# Altium schematic sheet Power.SchDoc
size A4; SheetNumber: 4; SheetTotal: 5; SPICEModelCacheOQVMKSBN: <root> / <DocumentId>OQVMKSBN</DocumentId> / </root>
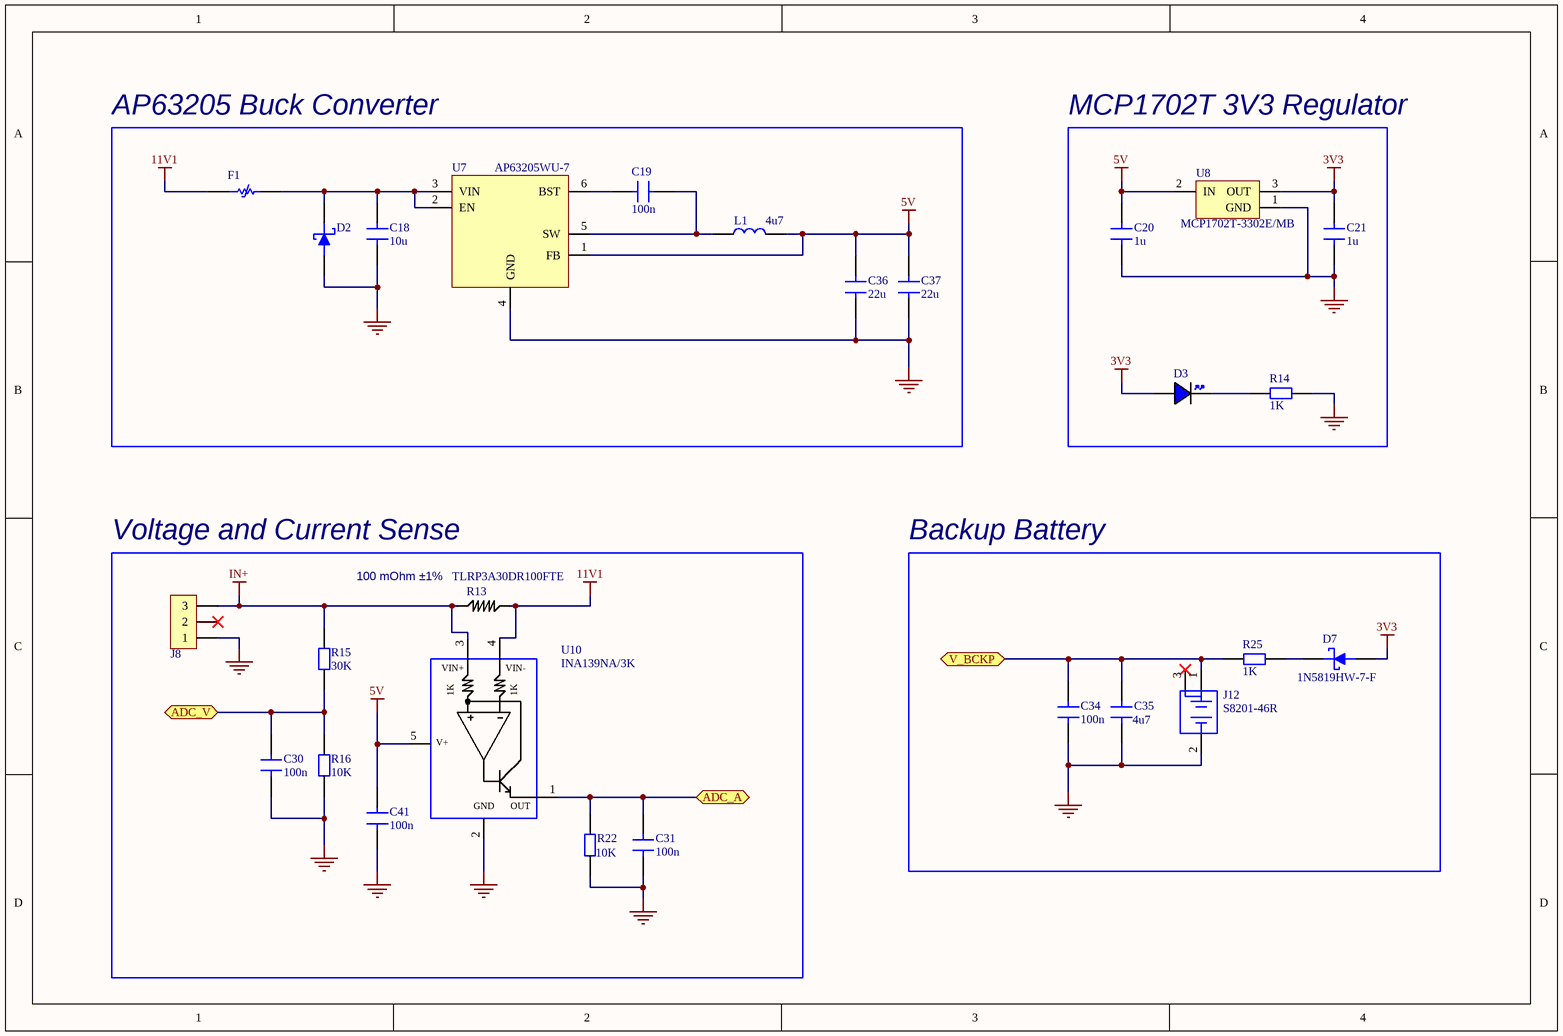
[diagram p0: Power.SchDoc]

## Parts
C18  10u  [CAP 1210]
C19  100n  [CAP 0805]
C20  1u  [CAP 0805]
C21  1u  [CAP 0805]
C30  100n  [CAP 0805]
C31  100n  [CAP 0805]
C34  100n  [CAP 0603]
C35  4u7  [CAP 0805]
C36  22u  [CAP 1210]
C37  22u  [CAP 1210]
C41  100n  [CAP 0805]
D2  SMBJ14CA  [SMBJ12CA-13-F]  (value not drawn)
D3  LED 0805 BLUE  [LED 0805 BLUE]  (value not drawn)
D7  1N5819HW-7-F  [1N5819HW-7-F]
F1  MF-MSMF075/24-2  [0ZCG0075FF2C]  (value not drawn)
J8  JST B3B-XH-A  [JST_B3B-XH-A]  (value not drawn)
J12  S8201-46R  [S8201-46R]
L1  4u7  [IHLP2020CZER4R7M11]
R13  TLRP3A30DR100FTE  [RES 2512]
R14  1K  [RES 0603]
R15  30K  [RES 0805]
R16  10K  [RES 0805]
R22  10K  [RES 0805]
R25  1K  [RES 0603]
U7  AP63205WU-7  [AP63205]
U8  MCP1702T-3302E/MB  [MCP1702T-3302E/MB]
U10  INA139NA/3K  [INA139NA]

## Blocks framed on the sheet
AP63205 Buck Converter: C18 C19 C36 C37 D2 F1 L1 U7
MCP1702T 3V3 Regulator: C20 C21 D3 R14 U8
Voltage and Current Sense: C30 C31 C41 J8 R13 R15 R16 R22 U10
Backup Battery: C34 C35 D7 J12 R25

## Ports
ADC_A (bidir, see MCU[2B]), ADC_V (bidir, see MCU[2B]), V_BCKP (bidir, see MCU[3A], Peripherals[5B])

## Nets
3V3: C21.2 D3.A D7.C U8.3(OUT)
5V: C20.2 C36.2 C37.2 C41.2 L1.2 U7.1(FB) U8.2(IN) U10.5(V+)
11V1: F1.1 R13.1 U10.4(VIN+)
GND: C18.1 C20.1 C21.1 C30.1 C31.1 C34.1 C35.1 C36.1 C37.1 C41.1 D2.1 J8.1 J12.2(-) R14.2 R16.1 R22.1 U7.4(GND) U8.1(GND) U10.2(GND)
IN+: J8.3 R13.2 R15.2 U10.3(VIN+)
ADC_A: C31.2 R22.2 U10.1(OUT) ; port ADC_A
ADC_V: C30.2 R15.1 R16.2 ; port ADC_V
V_BCKP: C34.2 C35.2 J12.1(+) R25.1 ; port V_BCKP
NetC18_2: C18.2 D2.2 F1.2 U7.2(EN) U7.3(VIN)
NetC19_1: C19.1 L1.1 U7.5(SW)
NetC19_2: C19.2 U7.6(BST)
NetD3_K: D3.K R14.1
NetD7_A: D7.A R25.2

Not connected (* = marked no-connect by the designer): J8 2*; J12 3(+)*

## Notes on the sheet
- (near R13) 100 mOhm ±1%
- (in symbol INA139NA/3K) VIN-; 1K

## Library data of the parts
C18 = CAP 1210 50V: Capacitor SMD 1210 50V
C19-C21 C30 C31 C41 = CAP 0805 50V: Capacitor SMD 0805 50V
C34 = CAP 0603 50V: Capacitor SMD 0603 50V
C35 = CAP 0805 25V: Capacitor SMD 0805 25V
C36 C37 = CAP 1210 25V: Capacitor SMD 1210 25V
D2 = SMBJ14CA: TVS DIODE 14VWM 23.2VC DO214AA; Manufacturer: Littelfuse; Operating Supply Voltage: 14V; Max Surge Current: 25.9A; Number of Channels: 1; Polarity: Bidirectional; Breakdown Voltage: 15.6V; Clamping Voltage: 23.2V; Peak Pulse Power: 600W; Power Line Protection: No; Test Current: 1mA; Leakage Current: 1uA; Diode Type: ZENER; Max Breakdown Voltage: 17.2V; Supplier 1: Future Electronics; Manufacturer Part Number: SMBJ14CA; RoHS: Yes; Category: TVS Diodes; Stock 1: 1300; Pricing 1: 1=0,36, 15=0,29, 75=0,245, 300=0,205, 1500=0,163 (USD); Mount: Surface Mount; Case/Package: DO-214AA; Number of Pins: 2; Weight: 0.00328oz; Min Operating Temperature: -65°C; Max Operating Temperature: 150°C; Packaging: Tape and Reel; Package Quantity: 3000; Reverse Breakdown Voltage: 15.6V; Number of Bidirectional Channels: 1; Reverse Standoff Voltage: 14V; Min Breakdown Voltage: 15.6V; Number of Elements: 1; Peak Pulse Current: 25.9A; Voltage Rating (DC): 14V; Series: SMBJ; Direction: Bidirectional; Termination: SMD/SMT; Max Power Dissipation: 600W; Power Dissipation: 600W; Current: 1mA; Voltage: 14V; Clamping Voltage-Max: 23.2V; Length: 5.59mm; Width: 3.94mm; Height: 2.44mm; RoHS Compliant: Yes; Lead Free: Lead Free; Reach SVHC Compliant: No; ComponentLink1URL: https://datasheet.ciiva.com/331/littelfuse-tvs-diode-smbj-datasheet-pdf-331530.pdf?src-supplier=Digikey; ComponentLink1Description: https://datasheet.ciiva.com/331/littelfuse-tvs-diode-smbj-datasheet-pdf-331530.pdf?src-supplier=Digikey; ComponentLink2URL: https://datasheet.ciiva.com/331/littelfuse-tvs-diode-smbj-datasheet-pdf-331531.pdf?src-supplier=Digikey; ComponentLink2Description: https://datasheet.ciiva.com/331/littelfuse-tvs-diode-smbj-datasheet-pdf-331531.pdf?src-supplier=Digikey; ComponentLink3URL: https://datasheet.ciiva.com/331/littelfuse-tvs-diode-smbj-datasheet-pdf-331529.pdf?src-supplier=Digikey; ComponentLink3Description: https://datasheet.ciiva.com/331/littelfuse-tvs-diode-smbj-datasheet-pdf-331529.pdf?src-supplier=Digikey
D3 = LED 0805 BLUE: LED 0805 GREEN SMD
D7 = 1N5819HW-7-F: Rectifier Diode, Schottky, 1 Phase, 1 Element, 1A, 40V V(RRM), Silicon; Manufacturer: Diodes; Max Reverse Current: 50uA; Peak Non-Repetitive Surge Current: 25A; Forward Voltage: 450mV; Max Power Dissipation: 450mW; Polarity: Standard; Capacitance: 50pF; Supplier 1: Future Electronics; Manufacturer Part Number: 1N5819HW-7-F; RoHS: Yes; Category: Rectifier Diodes; Stock 1: 5079000; Pricing 1: 3000=0,0409, 9000=0,0394, 15000=0,0388, 60000=0,037, 90000=0,0358 (USD); Case/Package: SOD-123-2; Number of Pins: 2; Weight: 0.000353oz; Min Operating Temperature: -65°C; Max Operating Temperature: 125°C; Forward Current: 1A; Max Repetitive Reverse Voltage (Vrrm): 40V; Package Quantity: 3000; Packaging: Tape and Reel; Average Rectified Current: 1A; Max Forward Surge Current (Ifsm): 25A; Termination: SMD/SMT; Voltage Rating (DC): 40V; Current Rating: 1A; Output Current: 1A; Max Reverse Voltage (DC): 40V; Series: -; Reverse Voltage: 40V; Length: 2.85mm; Width: 1.7mm; Height: 1.25mm; Radiation Hardening: No; Reach SVHC Compliant: No; Lead Free: Lead Free; RoHS Compliant: Yes; ComponentLink1URL: https://datasheet.ciiva.com/27092/1538419-27092484.pdf?src-supplier=Jameco; ComponentLink1Description: https://datasheet.ciiva.com/27092/1538419-27092484.pdf?src-supplier=Jameco; ComponentLink2URL: https://datasheet.ciiva.com/16303/ds30217-16303296.pdf?src-supplier=Future+Electronics; ComponentLink2Description: https://datasheet.ciiva.com/16303/ds30217-16303296.pdf?src-supplier=Future+Electronics; ComponentLink3URL: https://datasheet.ciiva.com/1177/ds30217-1177089.pdf?src-supplier=Element14; ComponentLink3Description: https://datasheet.ciiva.com/1177/ds30217-1177089.pdf?src-supplier=Element14; ComponentLink4URL: https://datasheet.ciiva.com/8303/ds30217-8303132.pdf?src-supplier=Avnet; ComponentLink4Description: https://datasheet.ciiva.com/8303/ds30217-8303132.pdf?src-supplier=Avnet; ComponentLink5URL: https://datasheet.ciiva.com/912/ds30217-912802.pdf?src-supplier=Digikey; ComponentLink5Description: https://datasheet.ciiva.com/912/ds30217-912802.pdf?src-supplier=Digikey; ComponentLink6URL: https://datasheet.ciiva.com/912/ds30217-912803.pdf?src-supplier=Digikey; ComponentLink6Description: https://datasheet.ciiva.com/912/ds30217-912803.pdf?src-supplier=Digikey; ComponentLink7URL: https://datasheet.ciiva.com/912/ds30217-912801.pdf?src-supplier=Digikey; ComponentLink7Description: https://datasheet.ciiva.com/912/ds30217-912801.pdf?src-supplier=Digikey
F1 = MF-MSMF075/24-2: PTC Resettable Fuse 0.75A(hold) 1.5A(trip) 24V 40A 0.8W 0.2s 0.11Ohm SMD Solder Pad 1812 T/R Automotive; Manufacturer: Bourns; Supplier 1: Arrow Electronics; Manufacturer Part Number: MF-MSMF075/24-2; RoHS: Yes; Category: Fuses; Stock 1: 88000; Pricing 1: 4000=0,2686 (USD); Lead Free: 5697LeadFree; ComponentLink1URL: https://datasheet.ciiva.com/27091/1164226-27091560.pdf?src-supplier=Jameco; ComponentLink1Description: https://datasheet.ciiva.com/27091/1164226-27091560.pdf?src-supplier=Jameco; ComponentLink2URL: https://datasheet.ciiva.com/326/mfmsmf-326789.pdf?src-supplier=Digikey; ComponentLink2Description: https://datasheet.ciiva.com/326/mfmsmf-326789.pdf?src-supplier=Digikey; ComponentLink3URL: https://datasheet.ciiva.com/326/mfmsmf-326790.pdf?src-supplier=Digikey; ComponentLink3Description: https://datasheet.ciiva.com/326/mfmsmf-326790.pdf?src-supplier=Digikey; ComponentLink4URL: https://datasheet.ciiva.com/326/mfmsmf-326791.pdf?src-supplier=Digikey; ComponentLink4Description: https://datasheet.ciiva.com/326/mfmsmf-326791.pdf?src-supplier=Digikey; ComponentLink5URL: https://datasheet.ciiva.com/3019/mfmsmf-3019624.pdf?src-supplier=Avnet; ComponentLink5Description: https://datasheet.ciiva.com/3019/mfmsmf-3019624.pdf?src-supplier=Avnet; ComponentLink6URL: https://datasheet.ciiva.com/3019/mfmsmf-3019625.pdf?src-supplier=Avnet; ComponentLink6Description: https://datasheet.ciiva.com/3019/mfmsmf-3019625.pdf?src-supplier=Avnet; ComponentLink7URL: https://datasheet.ciiva.com/30254/575mfmsmf-30254266.pdf?src-supplier=Onlinecomponents.com; ComponentLink7Description: https://datasheet.ciiva.com/30254/575mfmsmf-30254266.pdf?src-supplier=Onlinecomponents.com; ComponentLink8URL: https://datasheet.ciiva.com/16205/mfmsmf-16205996.pdf?src-supplier=Onlinecomponents.com; ComponentLink8Description: https://datasheet.ciiva.com/16205/mfmsmf-16205996.pdf?src-supplier=Onlinecomponents.com; ComponentLink9URL: https://datasheet.ciiva.com/14539/70153434-14539177.pdf?src-supplier=Allied+Electronics; ComponentLink9Description: https://datasheet.ciiva.com/14539/70153434-14539177.pdf?src-supplier=Allied+Electronics; ComponentLink10URL: https://datasheet.ciiva.com/1228/1786007-1228156.pdf?src-supplier=Newark; ComponentLink10Description: https://datasheet.ciiva.com/1228/1786007-1228156.pdf?src-supplier=Newark; ComponentLink11URL: https://datasheet.ciiva.com/1274/1786007-1274502.pdf?src-supplier=Element14; ComponentLink11Description: https://datasheet.ciiva.com/1274/1786007-1274502.pdf?src-supplier=Element14; ComponentLink12URL: https://datasheet.ciiva.com/1274/1786007-1274503.pdf?src-supplier=Element14; ComponentLink12Description: https://datasheet.ciiva.com/1274/1786007-1274503.pdf?src-supplier=Element14
J8 = JST B3B-XH-A: Connector Header, XH Series, 3 Position, 2.50mm, Through Hole, Press-Fit, Solder, Natural; Manufacturer Part Number: B3B-XH-A(LF)(SN); Supplier 1: CoreStaff; Manufacturer: JST; RoHS: Yes; Category: Headers and Wire Housings; Stock 1: 2101; Pricing 1: 1=39,94, 10=25,1, 50=21,68, 100=18,25, 500=17,57, 1000=17,12, 2000=16,44, 4000=15,79 (JPY); ComponentLink1URL: https://datasheet.ciiva.com/26894/getdatasheetpartid-640434-26894454.pdf?src-supplier=Verical; ComponentLink1Description: https://datasheet.ciiva.com/26894/getdatasheetpartid-640434-26894454.pdf?src-supplier=Verical; ComponentLink2URL: https://datasheet.ciiva.com/26894/getdatasheetpartid-440399-26894778.pdf?src-supplier=Verical; ComponentLink2Description: https://datasheet.ciiva.com/26894/getdatasheetpartid-440399-26894778.pdf?src-supplier=Verical; ComponentLink3URL: https://datasheet.ciiva.com/11746/0900766b8082653f-11746520.pdf?src-supplier=Rs; ComponentLink3Description: https://datasheet.ciiva.com/11746/0900766b8082653f-11746520.pdf?src-supplier=Rs
J12 = S8201-46R: Battery Holder, Coin Cell, 1225, Smd Rohs Compliant: Yes |Harwin S8201-46R; Manufacturer: Harwin; Number of Contacts: 2NUMBER; Supplier 1: Farnell; Manufacturer Part Number: S8201-46R; RoHS: Yes; Category: Connectors; Stock 1: 4494; Pricing 1: 1=0,926, 25=0,765, 75=0,589, 200=0,555, 500=0,48 (EUR); Contact Material: 153,154ConductorMaterial; Height: 3.25mm; ComponentLink1URL: https://datasheet.ciiva.com/4/s8201r-4048.pdf?src-supplier=Digikey; ComponentLink1Description: https://datasheet.ciiva.com/4/s8201r-4048.pdf?src-supplier=Digikey; ComponentLink2URL: https://datasheet.ciiva.com/4642/c0430120-20coin20cell20battery20retainers-55143-4642583.pdf?src-supplier=Mouser; ComponentLink2Description: https://datasheet.ciiva.com/4642/c0430120-20coin20cell20battery20retainers-55143-4642583.pdf?src-supplier=Mouser; ComponentLink3URL: https://datasheet.ciiva.com/1391/1458706-1391064.pdf?src-supplier=Element14; ComponentLink3Description: https://datasheet.ciiva.com/1391/1458706-1391064.pdf?src-supplier=Element14; ComponentLink4URL: https://datasheet.ciiva.com/4/s8201r-4049.pdf?src-supplier=Digikey; ComponentLink4Description: https://datasheet.ciiva.com/4/s8201r-4049.pdf?src-supplier=Digikey
L1 = IHLP2020CZER4R7M11: Inductor Power Shielded Wirewound 4.7uH 20% 100KHz Powdered Iron 4.5A 60mOhm DCR 2020 T/R; Manufacturer: Vishay; Supplier 1: Mouser; Manufacturer Part Number: IHLP2020CZER4R7M11; RoHS: No; Category: Fixed Inductors; Stock 1: 10031; Pricing 1: 1=1,19, 10=1,02, 50=1,02, 100=0,828, 1000=0,828, 10000=0,473 (USD); ComponentLink1URL: https://datasheet.ciiva.com/14803/lp20cz11-14803040.pdf?src-supplier=Arrow+Electronics; ComponentLink1Description: https://datasheet.ciiva.com/14803/lp20cz11-14803040.pdf?src-supplier=Arrow+Electronics; ComponentLink2URL: https://datasheet.ciiva.com/11798/0900766b8102c930-11798346.pdf?src-supplier=Rs; ComponentLink2Description: https://datasheet.ciiva.com/11798/0900766b8102c930-11798346.pdf?src-supplier=Rs; ComponentLink3URL: https://datasheet.ciiva.com/22694/480942-22694470.pdf?src-supplier=Element14; ComponentLink3Description: https://datasheet.ciiva.com/22694/480942-22694470.pdf?src-supplier=Element14; ComponentLink4URL: https://datasheet.ciiva.com/8017/480942-8017228.pdf?src-supplier=Element14; ComponentLink4Description: https://datasheet.ciiva.com/8017/480942-8017228.pdf?src-supplier=Element14; ComponentLink5URL: https://datasheet.ciiva.com/8494/lp20cz11-8494950.pdf?src-supplier=Avnet; ComponentLink5Description: https://datasheet.ciiva.com/8494/lp20cz11-8494950.pdf?src-supplier=Avnet; ComponentLink6URL: https://datasheet.ciiva.com/17112/70205433-17112327.pdf?src-supplier=Allied+Electronics; ComponentLink6Description: https://datasheet.ciiva.com/17112/70205433-17112327.pdf?src-supplier=Allied+Electronics; ComponentLink7URL: https://datasheet.ciiva.com/6688/lp20cz11-6688326.pdf?src-supplier=Digikey; ComponentLink7Description: https://datasheet.ciiva.com/6688/lp20cz11-6688326.pdf?src-supplier=Digikey; ComponentLink8URL: https://datasheet.ciiva.com/6688/lp20cz11-6688327.pdf?src-supplier=Digikey; ComponentLink8Description: https://datasheet.ciiva.com/6688/lp20cz11-6688327.pdf?src-supplier=Digikey; ComponentLink9URL: https://datasheet.ciiva.com/6688/lp20cz11-6688329.pdf?src-supplier=Digikey; ComponentLink9Description: https://datasheet.ciiva.com/6688/lp20cz11-6688329.pdf?src-supplier=Digikey
R13 = TLRP3A30DR100FTE: Res, 0R1, 1%, 3W, Metal Strip, SMD Rohs Compliant: Yes; Manufacturer: TE Connectivity; Supplier 1: Farnell; Manufacturer Part Number: TLRP3A30DR100FTE; RoHS: No; Category: Chip SMD Resistors; Stock 1: 1580; Pricing 1: 10=0,393, 100=0,273, 500=0,221, 1000=0,179, 2000=0,177, 4000=0,166, 20000=0,163, 40000=0,159 (EUR)
R14 R25 = RES 0603: Resistor SMD 0603
R15 R16 R22 = RES 0805: Resistor SMD 0805
U7 = AP63205WU-7: AP63205 Series 32 V 2 A 1.1 MHz Synchronous Buck Converter -TSOT-26; Manufacturer: Diodes; Max Duty Cycle: 100%; Max Supply Voltage: 32V; Min Supply Voltage: 3.8V; Nominal Supply Current: 22uA; Number of Outputs: 1NUMBER; Output Current: 2A; Output Voltage: 5V; Switching Frequency: 1.1MHz; Supplier 1: Future Electronics; Manufacturer Part Number: AP63205WU-7; RoHS: Yes; Category: Voltage Regulators - Switching; Stock 1: 45000; Pricing 1: 3000=0,33, 6000=0,32 (USD); Min Operating Temperature: -40°C; Max Operating Temperature: 85°C; Height: 1mm; ComponentLink1URL: https://www.diodes.com/assets/Datasheets/AP63200-AP63201-AP63203-AP63205.pdf?src-supplier=Digikey; ComponentLink1Description: https://www.diodes.com/assets/Datasheets/AP63200-AP63201-AP63203-AP63205.pdf?src-supplier=Digikey
U8 = MCP1702T-3302E/MB: LDO Regulator Pos 3.3V 0.25A Automotive 4-Pin(3+Tab) SOT-89 T/R; Manufacturer: Microchip; Max Supply Voltage: 13.2V; Min Supply Voltage: 2.7V; Dropout Voltage: 525mV; Output Current: 250mA; Number of Outputs: 1; Input Bias Current: 2uA; Quiescent Current: 5uA; Polarity: Positive; Accuracy: 2%; Output Type: Fixed; Supplier 1: Arrow Electronics; Manufacturer Part Number: MCP1702T-3302E/MB; RoHS: Yes; Category: Voltage Regulators - Linear; Stock 1: 26000; Pricing 1: 1000=0,4964 (USD); Mount: Surface Mount; Case/Package: SOT-89; Number of Pins: 3; Min Operating Temperature: -40°C; Max Operating Temperature: 125°C; Max Input Voltage: 13.2V; Min Input Voltage: 2.7V; Max Output Current: 250mA; Output Voltage: 3.3V; Packaging: Tape and Reel; Package Quantity: 1000; Nominal Output Voltage: 3.3V; Number of Regulators: 1; Min Output Voltage: 3.3V; Max Output Voltage: 3.3V; Termination: SMD/SMT; Output Voltage Accuracy: 2%; Supply Current: 5uA; Length: 4.6mm; Width: 2.29mm; Height: 1.6mm; Reach SVHC Compliant: No; Lead Free: Lead Free; RoHS Compliant: Yes
U10 = INA139NA/3K: 2.7 to 36V, 440kHz Variable gain current sense amplifier 5-SOT-23 -40 to 125; Manufacturer: Texas Instruments; Supplier 1: Mouser; Manufacturer Part Number: INA139NA/3K; RoHS: Yes; Category: Amplifiers - Op Amps, Buffer, Instrumentation; Stock 1: 20541; Pricing 1: 1=1,5, 10=1,27, 50=1,27, 100=1,02, 1000=0,737, 10000=0,736 (USD); ComponentLink1URL: https://datasheet.ciiva.com/15128/getdatasheetpartid-248784-15128606.pdf?src-supplier=Verical; ComponentLink1Description: https://datasheet.ciiva.com/15128/getdatasheetpartid-248784-15128606.pdf?src-supplier=Verical; ComponentLink2URL: https://datasheet.ciiva.com/1939/ina139-1939992.pdf?src-supplier=Digikey; ComponentLink2Description: https://datasheet.ciiva.com/1939/ina139-1939992.pdf?src-supplier=Digikey; ComponentLink3URL: https://datasheet.ciiva.com/1939/ina139-1939993.pdf?src-supplier=Digikey; ComponentLink3Description: https://datasheet.ciiva.com/1939/ina139-1939993.pdf?src-supplier=Digikey; ComponentLink4URL: https://datasheet.ciiva.com/1939/ina139-1939994.pdf?src-supplier=Digikey; ComponentLink4Description: https://datasheet.ciiva.com/1939/ina139-1939994.pdf?src-supplier=Digikey; ComponentLink5URL: https://datasheet.ciiva.com/2976/ina169-2976115.pdf?src-supplier=Avnet; ComponentLink5Description: https://datasheet.ciiva.com/2976/ina169-2976115.pdf?src-supplier=Avnet